# Altium schematic sheet NFC电子名片原理图_2021-03-03.schdoc
size 143 x 71 mm
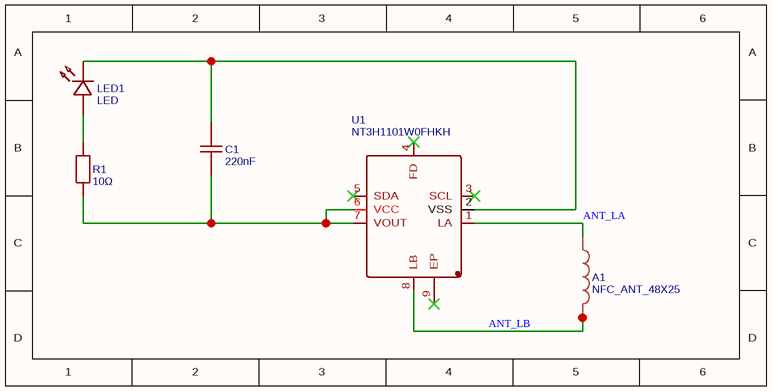
[diagram p0: NFC电子名片原理图_2021-03-03.schdoc]

## Parts
A1  NFC_ANT_48X25  [NFC_ANT_48X25]
C1  220nF  [C0603]
LED1  LED  [LED0603_BLUE]
R1  10Ω  [R0603]
U1  NT3H1101W0FHKH  [XQFN-8_L1.6-W1.6-P0.50-BR]

## Nets
ANT_LA: A1.A U1.1(LA)
ANT_LB: A1.B A1.P$3(B) U1.8(LB)
NetC1_1: C1.1 R1.1 U1.6(VCC) U1.7(VOUT)
NetC1_2: C1.2 LED1.2 U1.2(VSS)
NetLED1_1: LED1.1 R1.2

Not connected (* = marked no-connect by the designer): U1 3(SCL)* 4(FD)* 5(SDA)* 9(EP)*

## Library data of the parts
A1 = NFC_ANT_48X25: Contributor: elio1997; spicePre: ?; spiceSymbolName: NFC_ANT_48X25
C1 = 220nF: BOM_Manufacturer Part: 0603B224K160CT; BOM_Manufacturer: 华新科(Walsin); nameAlias: Value(F); Contributor: LCEDA_Lib; BOM_Supplier Part: C338153; BOM_Supplier: LCSC; spicePre: C; spiceSymbolName: C_0603_US
LED1 = LED: BOM_Manufacturer: 国星光电; BOM_Manufacturer Part: NCD0603G2; Contributor: LCEDA_01; BOM_Supplier Part: C87326; BOM_Supplier: LCSC; spicePre: L; spiceSymbolName: LED-0603_R
R1 = 10Ω: BOM_Manufacturer Part: 0603WAF100JT5E; BOM_Manufacturer: UNI-ROYAL(厚声); nameAlias: Value(Ω); Contributor: LCEDA_Lib; BOM_Supplier Part: C22859; BOM_Supplier: LCSC; spicePre: R; spiceSymbolName: R_0603_EU
U1 = NT3H1101W0FHKH: BOM_Manufacturer: NXP Semicon; Contributor: LCSC; SMT Type: Extend; BOM_Paste Type: expand; BOM_Assembly Type: smtWeld; BOM_Supplier: LCSC; BOM_Supplier Part: C73156; BOM_Manufacturer Part: NT3H1101W0FHKH; BOM_JLCPCB SMD: Yes; spicePre: U; spiceSymbolName: NT3H1101W0FHKH